# EAGLE design MS-FlipFlop (EAGLE 7.5.0)
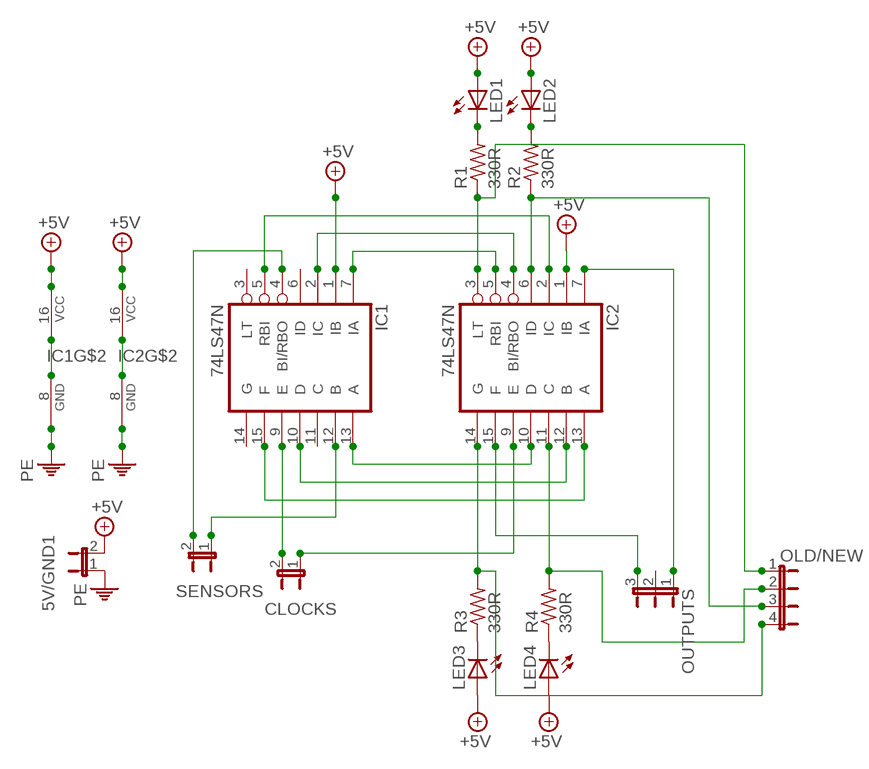
[diagram p0: schematic, sheet 1]

## Parts
5V/GND1  JP1E  [JP1]
CLOCKS  JP1E  [JP1]
IC1  74LS47N  [DIL16]
IC2  74LS47N  [DIL16]
LED1  LED5MM  [LED5MM]
LED2  LED5MM  [LED5MM]
LED3  LED5MM  [LED5MM]
LED4  LED5MM  [LED5MM]
OLD/NEW  JP4E  [JP4]
OUTPUTS  JP2E  [JP2]
R1  330R  R-US_0207/10  [0207/10]
R2  330R  R-US_0207/10  [0207/10]
R3  330R  R-US_0207/10  [0207/10]
R4  330R  R-US_0207/10  [0207/10]
SENSORS  JP1E  [JP1]

## Nets
+5V: 5V/GND1.2 IC1.1(IB) IC1.16(VCC) IC2.1(IB) IC2.16(VCC) LED1.A LED2.A LED3.A LED4.A
N$3: IC1.2(IC) IC2.4(BI/RBO)
N$4: IC1.5(RBI) IC2.2(IC)
N$5: IC1.7(IA) IC2.5(RBI)
N$6: IC1.10(D) IC2.12(B)
N$7: IC1.13(A) IC2.10(D)
N$8: IC1.15(F) IC2.13(A)
N$9: IC2.3(LT) OLD/NEW.1 R1.1
N$10: LED1.K(C) R1.2
N$11: LED2.K(C) R2.2
N$12: IC2.6(ID) OLD/NEW.3 R2.1
N$13: LED3.K(C) R3.1
N$14: LED4.K(C) R4.1
N$15: IC2.14(G) OLD/NEW.4 R3.2
N$16: IC2.11(C) OLD/NEW.2 R4.2
N$17: CLOCKS.2 IC1.9(E)
N$18: CLOCKS.1 IC2.9(E)
N$19: IC1.4(BI/RBO) SENSORS.2
N$20: IC1.12(B) SENSORS.1
N$21: IC2.15(F) OUTPUTS.3
N$22: IC2.7(IA) OUTPUTS.1
PE: 5V/GND1.1 IC1.8(GND) IC2.8(GND)
Unconnected: IC1.3(LT) IC1.6(ID) IC1.11(C) IC1.14(G) OUTPUTS.2

## Library data of the parts
5V/GND1 CLOCKS SENSORS = jumper:JP1E: JUMPER
IC1 IC2 = 74xx-us:74*47: BCD to seven segment DECODER/DRIVER Source: http://www.ee.washington.edu/stores/DataSheets/74ls/74ls47.pdf
LED1-LED4 = led:LED: LED OSRAM: - CHIPLED LG R971, LG N971, LY N971, LG Q971, LY Q971, LO R971, LY R971 LH N974, LH R974 LS Q976, LO Q976, LY Q976 LO Q996 - Hyper CHIPLED LW Q18S LB Q993, LB Q99A, LB R99A - SideLED LS A670, LO A670, LY A670, LG A670, LP A670 LB A673, LV A673, LT A673, LW A673 LH A674 LY A675 LS A676, LA A676, LO A676, LY A676, LW A676 LS A679, LY A679, LG A679 - Hyper Micro SIDELED® LS Y876, LA Y876, LO Y876, LY Y876 LT Y87S - SmartLED LW L88C, LW L88S LB L89C, LB L89S, LG L890 LS L89K, LO L89K, LY L89K LS L896, LA L896, LO L896, LY L896 - TOPLED LS T670, LO T670, LY T670, LG T670, LP T670 LSG T670, LSP T670, LSY T670, LOP T670, LYG T670 LG T671, LOG T671, LSG T671 LB T673, LV T673, LT T673, LW T673 LH T674 LS T676, LA T676, LO T676, LY T676, LB T676, LH T676, LSB T676, LW T676 LB T67C, LV T67C, LT T67C, LS T67K, LO T67K, LY T67K, LW E67C LS E67B, LA E67B, LO E67B, LY E67B, LB E67C, LV E67C, LT E67C LW T67C LS T679, LY T679, LG T679 LS T770, LO T770, LY T770, LG T770, LP T770 LB T773, LV T773, LT T773, LW T773 LH T774 LS E675, LA E675, LY E675, LS T675 LS T776, LA T776, LO T776, LY T776, LB T776 LHGB T686 LT T68C, LB T68C - Hyper Mini TOPLED® LB M676 - Mini TOPLED Santana® LG M470 LS M47K, LO M47K, LY M47K Source: http://www.osram.convergy.de LUXEON: - LUMILED® LXK2-PW12-R00, LXK2-PW12-S00, LXK2-PW14-U00, LXK2-PW14-V00 LXK2-PM12-R00, LXK2-PM12-S00, LXK2-PM14-U00 LXK2-PE12-Q00, LXK2-PE12-R00, LXK2-PE12-S00, LXK2-PE14-T00, LXK2-PE14-U00 LXK2-PB12-K00, LXK2-PB12-L00, LXK2-PB12-M00, LXK2-PB14-N00, LXK2-PB14-P00, LXK2-PB14-Q00 LXK2-PR12-L00, LXK2-PR12-M00, LXK2-PR14-Q00, LXK2-PR14-R00 LXK2-PD12-Q00, LXK2-PD12-R00, LXK2-PD12-S00 LXK2-PH12-R00, LXK2-PH12-S00 LXK2-PL12-P00, LXK2-PL12-Q00, LXK2-PL12-R00 Source: www.luxeon.com KINGBRIGHT: KA-3528ASYC Source: www.kingbright.com
OLD/NEW = jumper:JP4E: JUMPER
OUTPUTS = jumper:JP2E: JUMPER
R1-R4 = resistor:R-US_: RESISTOR, American symbol

## Board
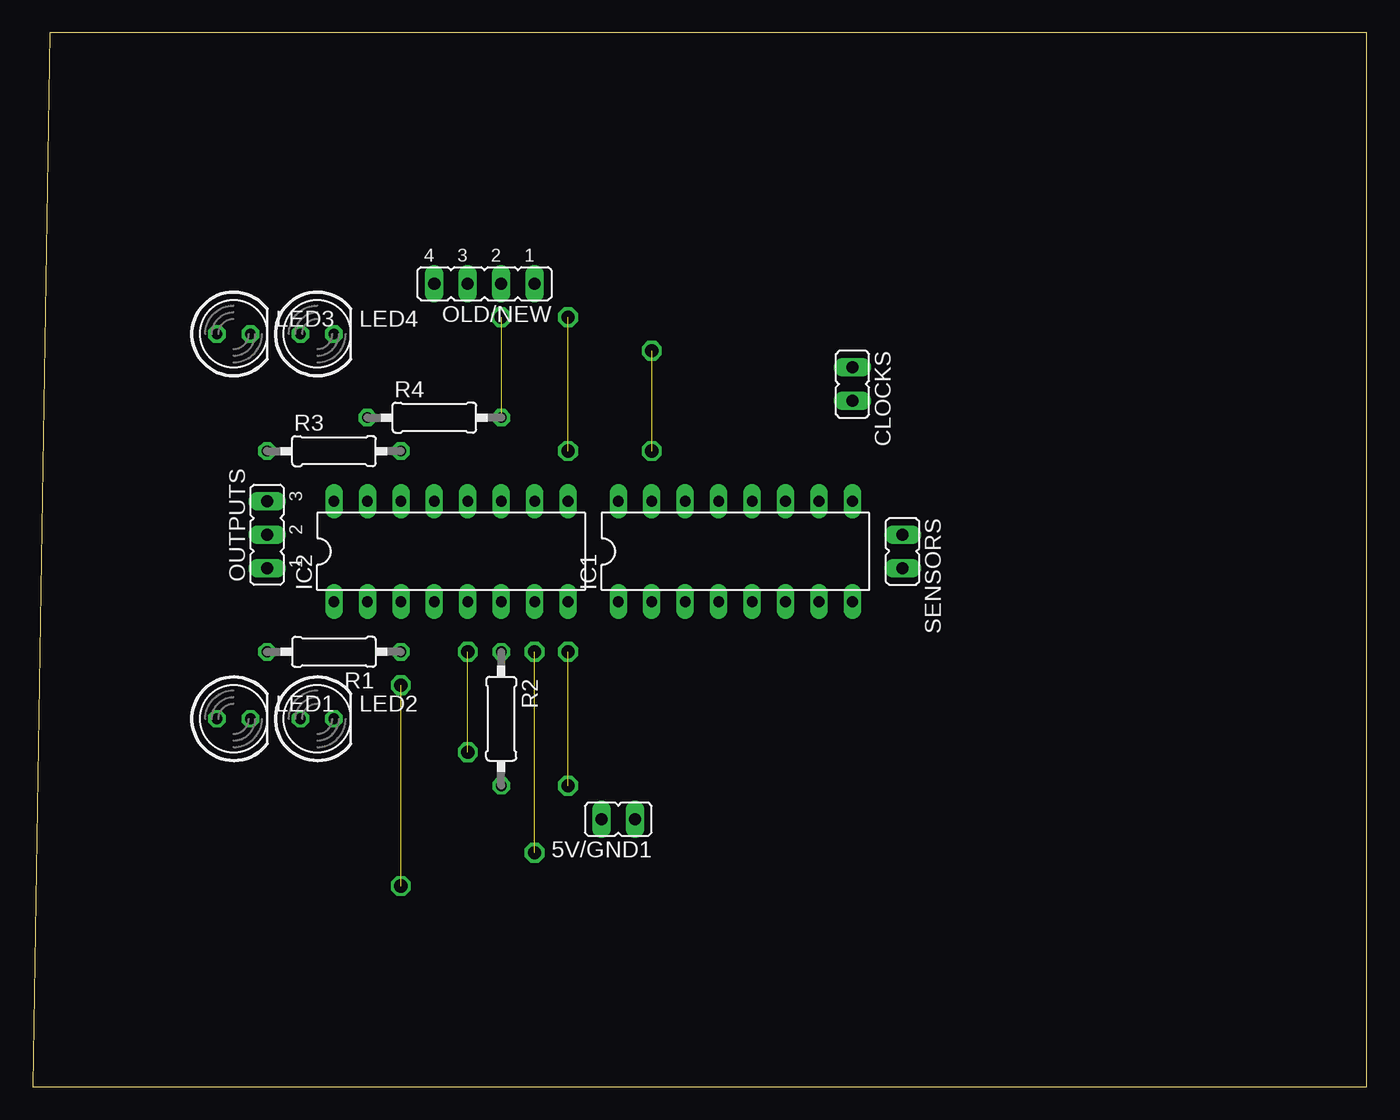
[diagram p1: board, top side]
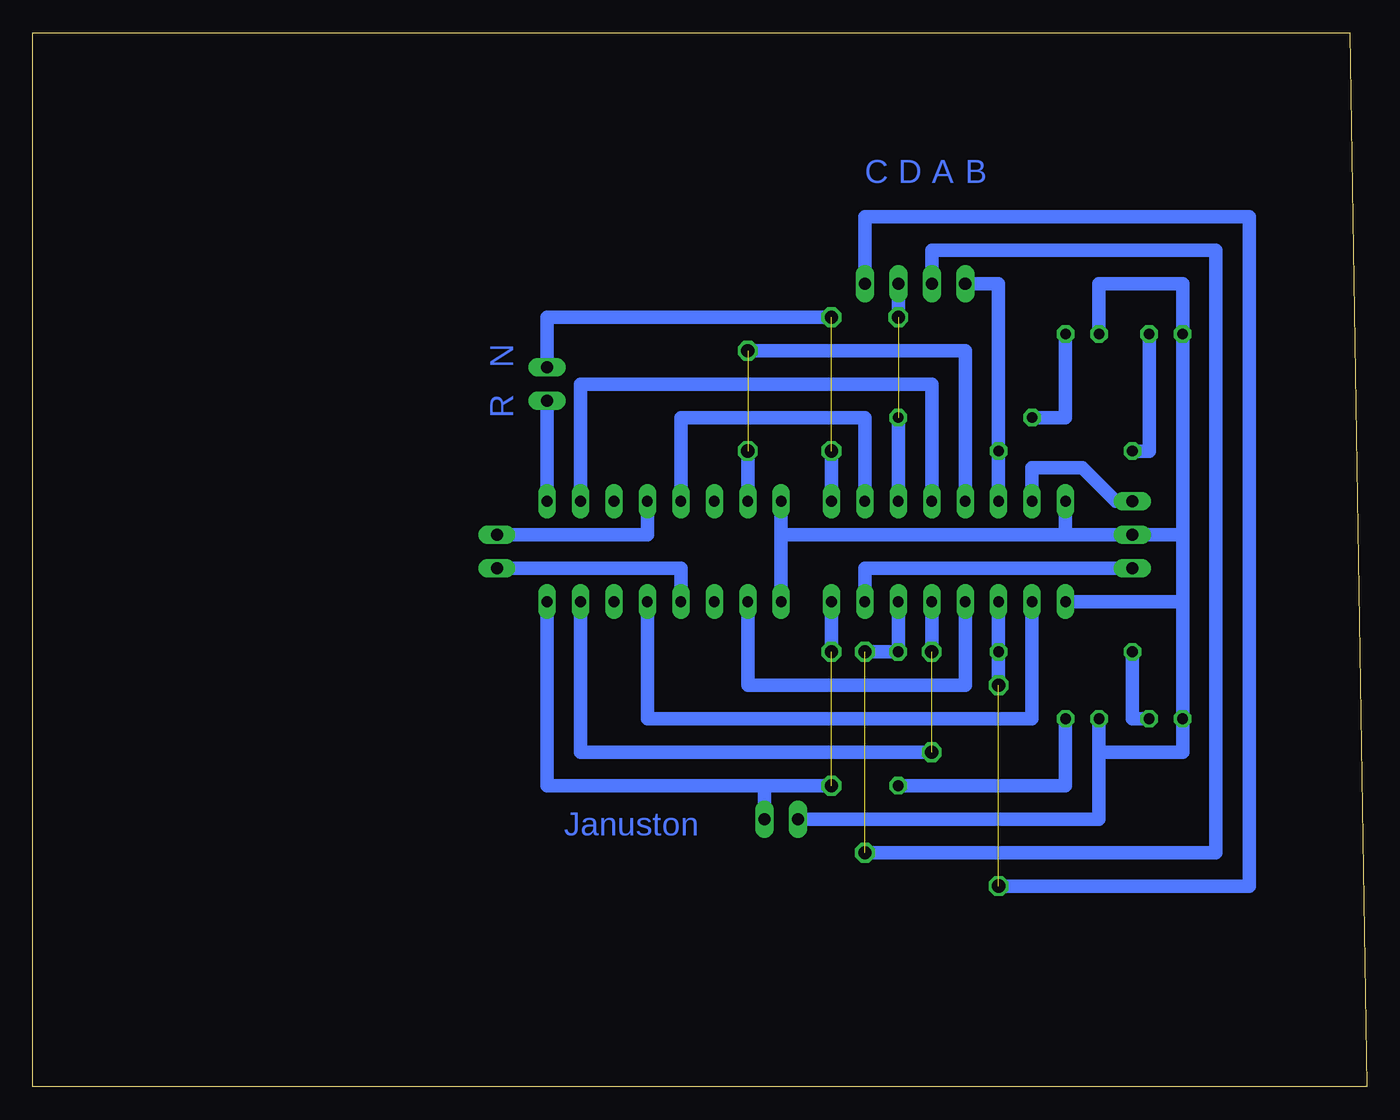
[diagram p2: board, bottom side, seen from below]

Size 101.27 x 80 mm. Coordinates in mm from the lower left corner, seen from the top.
Outline: 0,0 101.27,0 101.27,80 1.27,80 0,0
Copper layers (1*16): Top 0.035mm / dielectric 1.5mm / Bottom 0.035mm
Design rules "default": minimum track width 10mil, minimum drill 24mil, track to track 8mil, track to pad 8mil, pad to pad 8mil, via to via 8mil, smd to smd 8mil, copper to edge 40mil, drill to drill 8mil, minimum pad ring 10mil, minimum via ring 8mil, stop-mask expansion 4mil, vias tented up to drill 0mil, thermal gap 10mil

### Footprints (pad centres in the part's own frame; a part is rotated, then mirrored left to right if it is on the bottom)
JP1 = drill 0.914 long: 1 0,-1.27; 2 0,1.27
DIL16 = drill 0.813 long: 1 -8.89,-3.81; 2 -6.35,-3.81; 3 -3.81,-3.81; 4 -1.27,-3.81; 5 1.27,-3.81; 6 3.81,-3.81; 7 6.35,-3.81; 8 8.89,-3.81; 9 8.89,3.81; 10 6.35,3.81; 11 3.81,3.81; 12 1.27,3.81; 13 -1.27,3.81; 14 -3.81,3.81; 15 -6.35,3.81; 16 -8.89,3.81
LED5MM = drill 0.813 octagon: A -1.27,0; K 1.27,0
JP4 = drill 0.914 long: 1 -3.81,0; 2 -1.27,0; 3 1.27,0; 4 3.81,0
JP2 = drill 0.914 long: 1 -2.54,0; 2 0,0; 3 2.54,0
0207/10 = drill 0.813 octagon: 1 -5.08,0; 2 5.08,0

### Placement (x,y rotation side)
5V/GND1  44.45,20.32 90 top
CLOCKS  62.23,53.34 180 top
IC1  53.34,40.64 0 top
IC2  31.75,40.64 0 top
LED1  15.24,27.94 0 top
LED2  21.59,27.94 0 top
LED3  15.24,57.15 0 top
LED4  21.59,57.15 0 top
OLD/NEW  34.29,60.96 180 top
OUTPUTS  17.78,41.91 90 top
R1  22.86,33.02 180 top
R2  35.56,27.94 270 top
R3  22.86,48.26 0 top
R4  30.48,50.8 0 top
SENSORS  66.04,40.64 180 top

### Tracks (layer width: path | path; a pad name or v marks a point on that pad's centre or on a via)
+5V
  Bottom 1.016: IC1.16 44.45,41.91 | 44.45,41.91 IC1.1 | IC2.16 22.86,41.91 | 22.86,41.91 44.45,41.91 | 13.97,41.91 LED1.A 13.97,25.4 20.32,25.4 | 13.97,41.91 LED3.A 13.97,60.96 20.32,60.96 LED4.A | 13.97,41.91 22.86,41.91 | IC2.1 13.97,36.83 | LED2.A 20.32,25.4 | 20.32,25.4 20.32,20.32 5V/GND1.2
N$3
  Bottom 1.016: IC2.4 30.48,30.48 46.99,30.48 IC1.2
N$4
  Bottom 1.016: IC2.2 25.4,27.94 54.61,27.94 IC1.5
N$5  (via drill 1)  (1 unrouted)
  Bottom 1.016: IC1.7 59.69,25.4 v33.02,25.4 | IC2.5 v33.02,33.02
N$6
  Bottom 1.016: IC1.10 59.69,53.34 33.02,53.34 IC2.12
N$7
  Bottom 1.016: IC1.13 52.07,50.8 38.1,50.8 IC2.10
N$8  (via drill 1)  (1 unrouted)
  Bottom 1.016: IC1.15 v46.99,48.26 | IC2.13 30.48,55.88 v46.99,55.88
N$9  (via drill 1)  (1 unrouted)
  Bottom 1.016: IC2.3 R1.1 v27.94,30.48 | OLD/NEW.1 38.1,66.04 8.89,66.04 8.89,15.24 v27.94,15.24
N$10
  Bottom 1.016: R1.2 17.78,27.94 LED1.K
N$11
  Bottom 1.016: LED2.K 22.86,22.86 R2.2
N$12  (via drill 1)  (1 unrouted)
  Bottom 1.016: IC2.6 R2.1 v38.1,33.02 | OLD/NEW.3 33.02,63.5 11.43,63.5 11.43,17.78 v38.1,17.78
N$13
  Bottom 1.016: LED3.K 16.51,48.26 R3.1
N$14
  Bottom 1.016: R4.1 22.86,50.8 LED4.K
N$15
  Bottom 1.016: R3.2 IC2.14 27.94,60.96 OLD/NEW.4
N$16  (via drill 1)  (1 unrouted)
  Bottom 1.016: R4.2 IC2.11 | OLD/NEW.2 v35.56,58.42
N$17
  Bottom 1.016: IC1.9 CLOCKS.2
N$18  (via drill 1)  (1 unrouted)
  Bottom 1.016: IC2.9 v40.64,48.26 | CLOCKS.1 62.23,58.42 v40.64,58.42
N$19
  Bottom 1.016: IC1.4 52.07,39.37 SENSORS.2
N$20
  Bottom 1.016: IC1.12 54.61,41.91 SENSORS.1
N$21
  Bottom 1.016: IC2.15 25.4,46.99 21.59,46.99 19.05,44.45 OUTPUTS.3
N$22
  Bottom 1.016: OUTPUTS.1 38.1,39.37 IC2.7
PE  (via drill 1)  (1 unrouted)
  Bottom 1.016: IC2.8 v40.64,33.02 | IC1.8 62.23,22.86 45.72,22.86 | 45.72,22.86 v40.64,22.86 | 5V/GND1.1 45.72,22.86

### Text on the board
Bottom: B | A | D | C | N | R | Januston